# EAGLE design midi_pad (EAGLE 9.6.2)
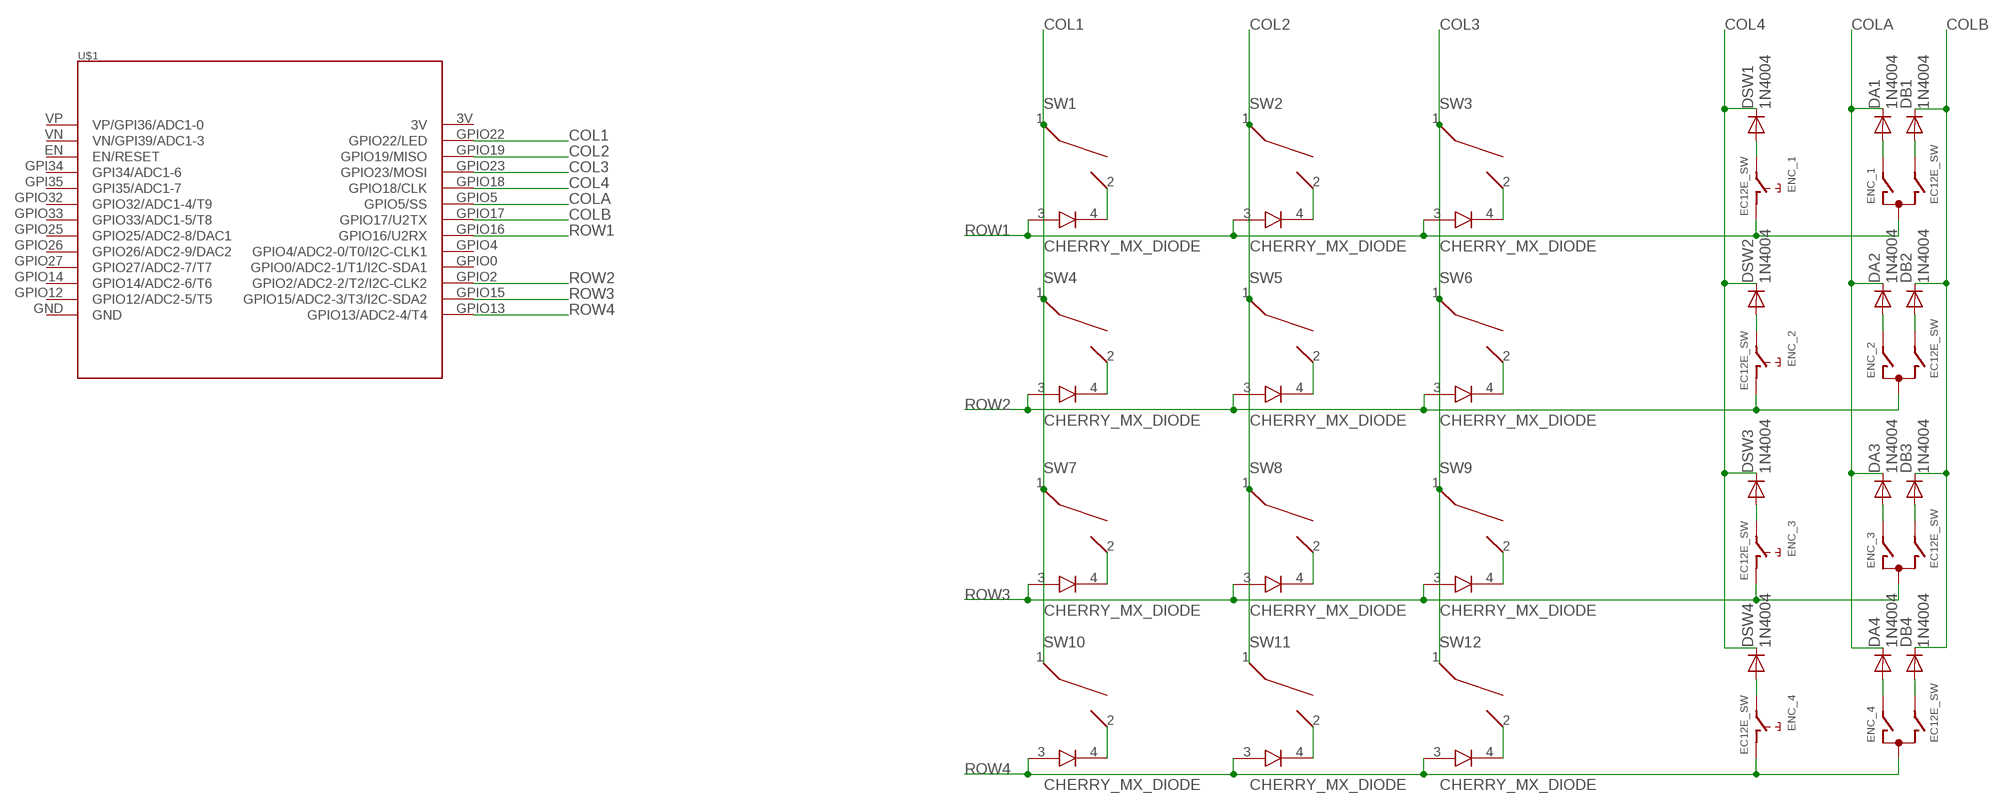
[diagram p0: schematic, sheet 1]

## Parts
DA1  1N4004  [DO41-10]
DA2  1N4004  [DO41-10]
DA3  1N4004  [DO41-10]
DA4  1N4004  [DO41-10]
DB1  1N4004  [DO41-10]
DB2  1N4004  [DO41-10]
DB3  1N4004  [DO41-10]
DB4  1N4004  [DO41-10]
DSW1  1N4004  [DO41-10]
DSW2  1N4004  [DO41-10]
DSW3  1N4004  [DO41-10]
DSW4  1N4004  [DO41-10]
ENC_1  EC12E_SW  [ALPS_EC12E_SW]
ENC_2  EC12E_SW  [ALPS_EC12E_SW]
ENC_3  EC12E_SW  [ALPS_EC12E_SW]
ENC_4  EC12E_SW  [ALPS_EC12E_SW]
SW1  CHERRY_MX_DIODE  [MX1A-XX[D/J]N]
SW2  CHERRY_MX_DIODE  [MX1A-XX[D/J]N]
SW3  CHERRY_MX_DIODE  [MX1A-XX[D/J]N]
SW4  CHERRY_MX_DIODE  [MX1A-XX[D/J]N]
SW5  CHERRY_MX_DIODE  [MX1A-XX[D/J]N]
SW6  CHERRY_MX_DIODE  [MX1A-XX[D/J]N]
SW7  CHERRY_MX_DIODE  [MX1A-XX[D/J]N]
SW8  CHERRY_MX_DIODE  [MX1A-XX[D/J]N]
SW9  CHERRY_MX_DIODE  [MX1A-XX[D/J]N]
SW10  CHERRY_MX_DIODE  [MX1A-XX[D/J]N]
SW11  CHERRY_MX_DIODE  [MX1A-XX[D/J]N]
SW12  CHERRY_MX_DIODE  [MX1A-XX[D/J]N]
U$1  LOLIN32_LITE  [LOLIN32_LITE]

## Nets
COL1: SW1.1 SW4.1 SW7.1 SW10.1 U$1.GPIO22(GPIO22/LED)
COL2: SW2.1 SW5.1 SW8.1 SW11.1 U$1.GPIO19(GPIO19/MISO)
COL3: SW3.1 SW6.1 SW9.1 SW12.1 U$1.GPIO23(GPIO23/MOSI)
COL4: DSW1.C DSW2.C DSW3.C DSW4.C U$1.GPIO18(GPIO18/CLK)
COLA: DA1.C DA2.C DA3.C DA4.C U$1.GPIO5(GPIO5/SS)
COLB: DB1.C DB2.C DB3.C DB4.C U$1.GPIO17(GPIO17/U2TX)
N$1: SW1.2 SW1.4
N$2: SW2.2 SW2.4
N$3: SW3.2 SW3.4
N$4: SW4.2 SW4.4
N$5: SW5.2 SW5.4
N$6: SW6.2 SW6.4
N$7: SW7.2 SW7.4
N$8: SW8.2 SW8.4
N$9: SW9.2 SW9.4
N$10: SW10.2 SW10.4
N$11: SW11.2 SW11.4
N$12: SW12.2 SW12.4
N$20: DSW1.A ENC_1.E
N$21: DA1.A ENC_1.A
N$22: DB1.A ENC_1.B
N$23: DSW2.A ENC_2.E
N$24: DA2.A ENC_2.A
N$25: DB2.A ENC_2.B
N$26: DSW3.A ENC_3.E
N$27: DA3.A ENC_3.A
N$28: DB3.A ENC_3.B
N$29: DSW4.A ENC_4.E
N$30: DA4.A ENC_4.A
N$31: DB4.A ENC_4.B
ROW1: ENC_1.C ENC_1.D SW1.3 SW2.3 SW3.3 U$1.GPIO16(GPIO16/U2RX)
ROW2: ENC_2.C ENC_2.D SW4.3 SW5.3 SW6.3 U$1.GPIO2(GPIO2/ADC2-2/T2/I2C-CLK2)
ROW3: ENC_3.C ENC_3.D SW7.3 SW8.3 SW9.3 U$1.GPIO15(GPIO15/ADC2-3/T3/I2C-SDA2)
ROW4: ENC_4.C ENC_4.D SW10.3 SW11.3 SW12.3 U$1.GPIO13(GPIO13/ADC2-4/T4)
Unconnected: ENC_1.GND1(G) ENC_1.GND2(G) ENC_2.GND1(G) ENC_2.GND2(G) ENC_3.GND1(G) ENC_3.GND2(G) ENC_4.GND1(G) ENC_4.GND2(G) U$1.3V U$1.EN(EN/RESET) U$1.GND U$1.GPI34(GPI34/ADC1-6) U$1.GPI35(GPI35/ADC1-7) U$1.GPIO0(GPIO0/ADC2-1/T1/I2C-SDA1) U$1.GPIO4(GPIO4/ADC2-0/T0/I2C-CLK1) U$1.GPIO12(GPIO12/ADC2-5/T5) U$1.GPIO14(GPIO14/ADC2-6/T6) U$1.GPIO25(GPIO25/ADC2-8/DAC1) U$1.GPIO26(GPIO26/ADC2-9/DAC2) U$1.GPIO27(GPIO27/ADC2-7/T7) U$1.GPIO32(GPIO32/ADC1-4/T9) U$1.GPIO33(GPIO33/ADC1-5/T8) U$1.VN(VN/GPI39/ADC1-3) U$1.VP(VP/GPI36/ADC1-0)

## Library data of the parts
DA1-DA4 DB1-DB4 DSW1-DSW4 = adafruit:1N4004: DIODE General purpose 1N400x type rectifier (With bigger pads) http://www.ladyada.net/library/pcb/eaglelibrary.html
ENC_1-ENC_4 = switch-alps:EC12E_SW: ALPS rotary Encoder EC12E series with switch; MPN: EC12E2424407; OC_FARNELL: 1520813; OC_NEWARK: 74M1068
SW1-SW12 = Cherry_MX_v7.0:CHERRY_MX_DIODE
U$1 = my_breakouts:LOLIN32_LITE

## Board
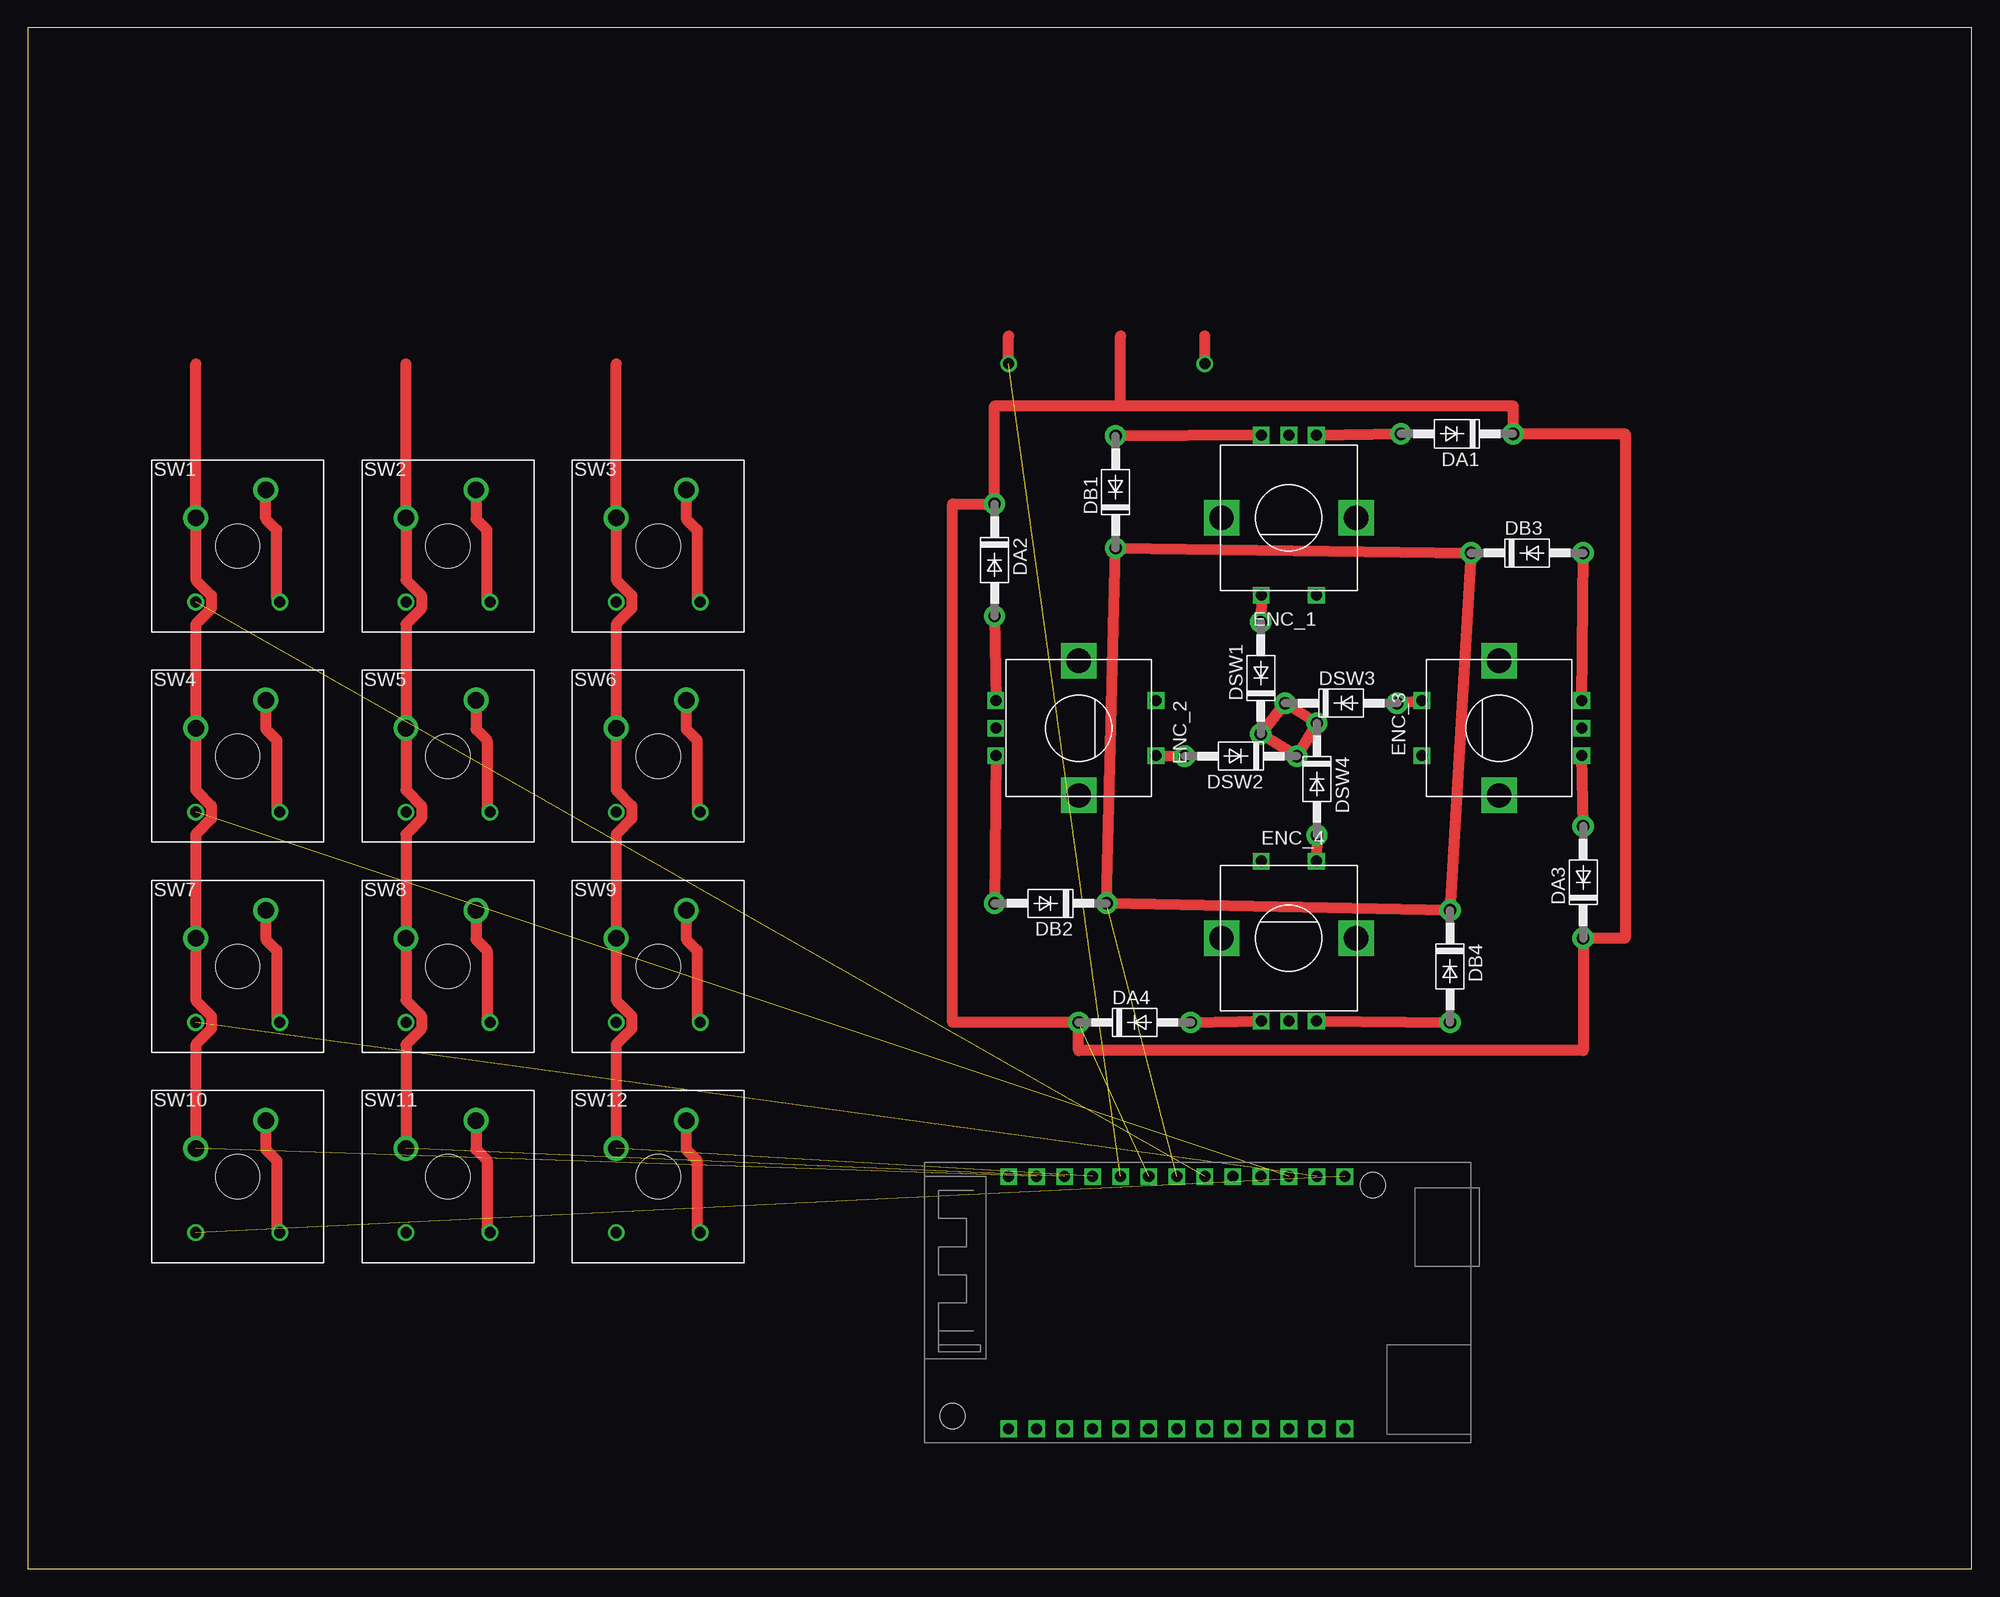
[diagram p1: board, top side]
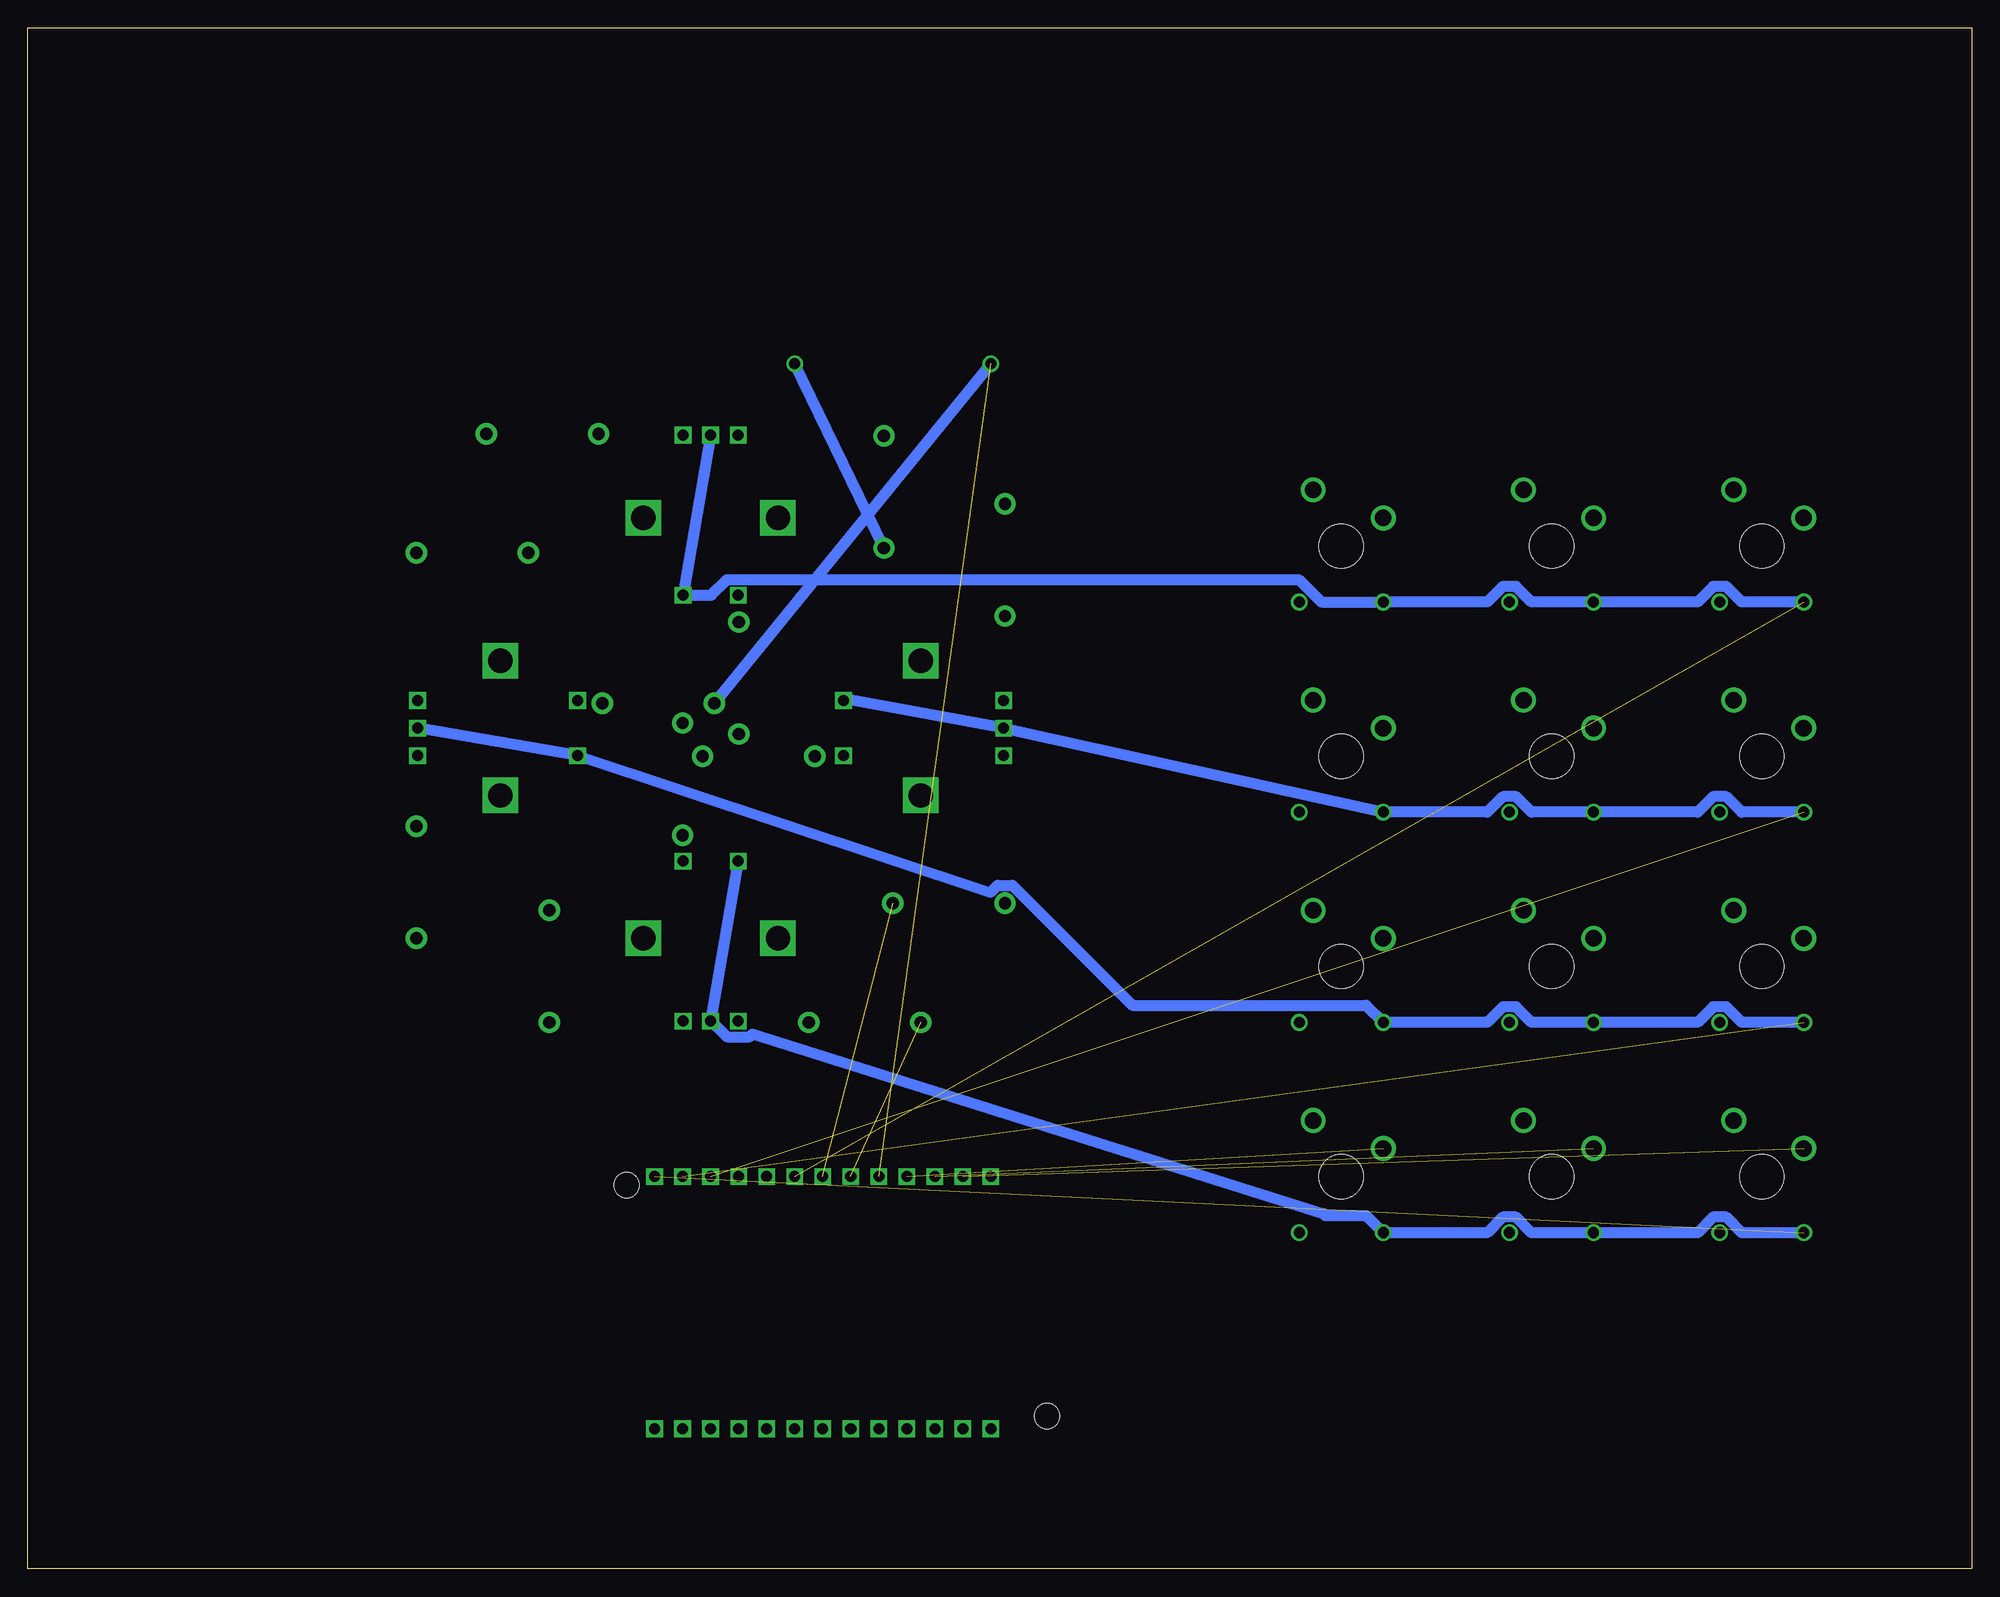
[diagram p2: board, bottom side, seen from below]

Size 176.2 x 139.69 mm. Coordinates in mm from the lower left corner, seen from the top.
Outline: 0,0 176.2,0 176.2,139.69 0,139.69 0,0
Copper layers (1*16): Top 0.035mm / dielectric 1.5mm / Bottom 0.035mm
Design rules "default": minimum track width 6mil, minimum drill 0.35mm, track to track 6mil, track to pad 6mil, pad to pad 6mil, via to via 6mil, smd to smd 6mil, copper to edge 40mil, drill to drill 6mil, minimum pad ring 10mil, minimum via ring 8mil, stop-mask expansion 4mil, vias tented up to drill 0mil, thermal gap 10mil

### Footprints (pad centres in the part's own frame; a part is rotated, then mirrored left to right if it is on the bottom)
DO41-10 = drill 1.118 pad 1.93: A 5.08,0; C -5.08,0
ALPS_EC12E_SW = drill 1 square: A -2.5,-7.5; B 2.5,-7.5; C 0,-7.5; D -2.5,7; E 2.5,7 | drill 2.2 square: GND1 -6.1,0; GND2 6.1,0
MX1A-XX[D/J]N = drill 1.5: 1 -3.81,2.54; 2 2.54,5.08 | drill 1: 3 -3.81,-5.08; 4 3.81,-5.08 | hole 4: 0,0
LOLIN32_LITE = drill 1 square: 3V 10.16,15.24; EN -12.7,10.16; GND -12.7,-15.24; GPI34 -12.7,7.62; GPI35 -12.7,5.08; GPIO0 10.16,-7.62; GPIO2 10.16,-10.16; GPIO4 10.16,-5.08; GPIO5 10.16,2.54; GPIO12 -12.7,-12.7; GPIO13 10.16,-15.24; GPIO14 -12.7,-10.16; GPIO15 10.16,-12.7; GPIO16 10.16,-2.54; GPIO17 10.16,0; GPIO18 10.16,5.08; GPIO19 10.16,10.16; GPIO22 10.16,12.7; GPIO23 10.16,7.62; GPIO25 -12.7,-2.54; GPIO26 -12.7,-5.08; GPIO27 -12.7,-7.62; GPIO32 -12.7,2.54; GPIO33 -12.7,0; VN -12.7,12.7; VP -12.7,15.24 | hole 2.286: 9.398,-17.78; -11.557,20.32

### Placement (x,y rotation side)
DA1  129.54,102.87 180 top
DA2  87.63,91.44 270 top
DA3  140.97,62.23 90 top
DA4  100.33,49.53 0 top
DB1  98.59,97.61 90 top
DB2  92.71,60.33 180 top
DB3  135.89,92.08 0 top
DB4  128.91,54.61 270 top
DSW1  111.76,80.74 90 top
DSW2  109.95,73.66 180 top
DSW3  119.04,78.46 0 top
DSW4  116.84,71.58 270 top
ENC_1  114.3,95.25 180 top
ENC_2  95.25,76.2 270 top
ENC_3  133.35,76.2 90 top
ENC_4  114.3,57.15 0 top
SW1  19.05,92.71 0 top
SW2  38.1,92.71 0 top
SW3  57.15,92.71 0 top
SW4  19.05,73.66 0 top
SW5  38.1,73.66 0 top
SW6  57.15,73.66 0 top
SW7  19.05,54.61 0 top
SW8  38.1,54.61 0 top
SW9  57.15,54.61 0 top
SW10  19.05,35.56 0 top
SW11  38.1,35.56 0 top
SW12  57.15,35.56 0 top
U$1  104.14,25.4 90 top

### Tracks (layer width: path | path; a pad name or v marks a point on that pad's centre or on a via)
COL1  (1 unrouted)
  Top 1.016: SW10.1 15.24,47.53 16.65,48.94 16.65,50.12 15.24,51.53 SW7.1 15.24,66.58 16.65,67.99 16.65,69.17 15.24,70.58 SW4.1 15.24,85.63 16.65,87.04 16.65,88.22 15.24,89.63 SW1.1 15.24,109.22
COL2  (1 unrouted)
  Top 1.016: SW11.1 34.29,47.53 35.7,48.94 35.7,50.12 34.29,51.53 SW8.1 34.29,66.58 35.7,67.99 35.7,69.17 34.29,70.58 SW5.1 34.29,85.63 35.7,87.04 35.7,88.22 34.29,89.63 SW2.1 34.29,109.22
COL3  (1 unrouted)
  Top 1.016: SW12.1 53.34,47.53 54.75,48.94 54.75,50.12 53.34,51.53 SW9.1 53.34,66.58 54.75,67.99 54.75,69.17 53.34,70.58 SW6.1 53.34,85.63 54.75,87.04 54.75,88.22 53.34,89.63 SW3.1 53.34,109.22
COL4  (via drill 1)  (1 unrouted)
  Top 1.016: v88.9,109.22 88.9,111.76 | DSW1.C DSW2.C DSW4.C DSW3.C DSW1.C
  Bottom 1.016: DSW3.C v88.9,109.22
COLA  (1 unrouted)
  Top 1.016: 99.06,105.41 87.63,105.41 DA2.C 83.82,96.52 83.82,49.53 DA4.C 95.25,46.99 140.97,46.99 DA3.C 144.78,57.15 144.78,102.87 DA1.C 134.62,105.41 99.06,105.41 | 99.06,105.41 99.06,111.76
COLB  (via drill 1)  (1 unrouted)
  Top 1.016: v106.68,109.22 106.68,111.76 | DB4.C DB2.C DB1.C DB3.C DB4.C
  Bottom 1.016: DB1.C v106.68,109.22
N$1
  Top 1.016: SW1.4 22.57,87.92 22.57,94.17 21.59,95.15 SW1.2
N$2
  Top 1.016: SW2.4 41.62,87.92 41.62,94.17 40.64,95.15 SW2.2
N$3
  Top 1.016: SW3.2 59.69,95.15 60.67,94.17 60.67,87.92 SW3.4
N$4
  Top 1.016: SW4.2 21.59,76.1 22.57,75.12 22.57,68.87 SW4.4
N$5
  Top 1.016: SW5.2 40.64,76.1 41.62,75.12 41.62,68.87 SW5.4
N$6
  Top 1.016: SW6.2 59.69,76.1 60.67,75.12 60.67,68.87 SW6.4
N$7
  Top 1.016: SW7.2 21.59,57.05 22.57,56.07 22.57,49.82 SW7.4
N$8
  Top 1.016: SW8.2 40.64,57.05 41.62,56.07 41.62,49.82 SW8.4
N$9
  Top 1.016: SW9.2 59.69,57.05 60.67,56.07 60.67,49.82 SW9.4
N$10
  Top 1.016: SW10.2 21.59,38 22.57,37.02 22.57,30.77 SW10.4
N$11
  Top 1.016: SW11.2 40.64,38 41.62,37.02 41.62,30.77 SW11.4
N$12
  Top 1.016: SW12.2 59.69,38 60.67,37.02 60.67,30.77 SW12.4
N$20
  Top 1.016: ENC_1.E DSW1.A
N$21
  Top 1.016: ENC_1.A DA1.A
N$22
  Top 1.016: ENC_1.B DB1.A
N$23
  Top 1.016: ENC_2.E DSW2.A
N$24
  Top 1.016: DA2.A ENC_2.A
N$25
  Top 1.016: ENC_2.B DB2.A
N$26
  Top 1.016: DSW3.A ENC_3.E
N$27
  Top 1.016: DA3.A ENC_3.A
N$28
  Top 1.016: ENC_3.B DB3.A
N$29
  Top 1.016: DSW4.A ENC_4.E
N$30
  Top 1.016: DA4.A ENC_4.A
N$31
  Top 1.016: ENC_4.B DB4.A
ROW1  (1 unrouted)
  Bottom 1.016: SW1.3 20.86,87.63 22.27,89.04 23.45,89.04 24.86,87.63 SW2.3 39.91,87.63 41.32,89.04 42.5,89.04 43.91,87.63 SW3.3 58.96,87.63 60.99,89.66 112.83,89.66 114.24,88.25 ENC_1.D ENC_1.C
ROW2  (1 unrouted)
  Bottom 1.016: SW4.3 20.86,68.58 22.27,69.99 23.45,69.99 24.86,68.58 SW5.3 39.91,68.58 41.32,69.99 42.5,69.99 43.91,68.58 SW6.3 ENC_2.C 101.6,78.74 ENC_2.D
ROW3  (1 unrouted)
  Bottom 1.016: SW7.3 20.86,49.53 22.27,50.94 23.45,50.94 24.86,49.53 SW8.3 39.91,49.53 41.32,50.94 42.5,50.94 43.91,49.53 SW9.3 54.9,51.09 76.09,51.09 86.96,61.95 88.3,61.95 88.94,61.31 ENC_3.D ENC_3.C
ROW4  (1 unrouted)
  Bottom 1.016: SW10.3 20.86,30.48 22.27,31.89 23.45,31.89 24.86,30.48 SW11.3 39.91,30.48 41.32,31.89 42.5,31.89 43.91,30.48 SW12.3 54.9,32.04 58.61,32.04 58.76,32.18 110.54,48.47 110.77,48.24 112.83,48.24 114.24,49.65 ENC_4.C ENC_4.D